# Altium project Booster_Sensors.PrjPcb
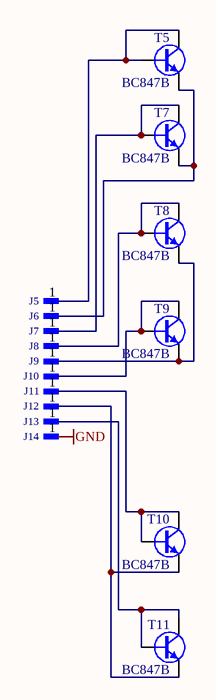
[diagram p0: Booster_Sensors.SchDoc]
1 sheet, 16 parts. Net scope: global (net labels, ports and power ports of the same name join across sheets).
Board file: Booster_Sensors.PcbDoc

## Sheet Booster_Sensors.SchDoc
size A4

### Parts
J5  SMD Pad  [R700X200]  (value not drawn)
J6  SMD Pad  [R700X200]  (value not drawn)
J7  SMD Pad  [R700X200]  (value not drawn)
J8  SMD Pad  [R700X200]  (value not drawn)
J9  SMD Pad  [R700X200]  (value not drawn)
J10  SMD Pad  [R700X200]  (value not drawn)
J11  SMD Pad  [R700X200]  (value not drawn)
J12  SMD Pad  [R700X200]  (value not drawn)
J13  SMD Pad  [R700X200]  (value not drawn)
J14  SMD Pad  [R700X200]  (value not drawn)
T5  BC847B  [SOT95P230X110-3N]
T7  BC847B  [SOT95P230X110-3N]
T8  BC847B  [SOT95P230X110-3N]
T9  BC847B  [SOT95P230X110-3N]
T10  BC847B  [SOT95P230X110-3N]
T11  BC847B  [SOT95P230X110-3N]

### Nets
GND: J14.1
NetJ5_1: J5.1 T5.1(B) T5.3(C)
NetJ6_1: J6.1 T5.2(E) T7.2(E)
NetJ7_1: J7.1 T7.1(B) T7.3(C)
NetJ8_1: J8.1 T8.1(B) T8.3(C)
NetJ9_1: J9.1 T8.2(E) T9.2(E)
NetJ10_1: J10.1 T9.1(B) T9.3(C)
NetJ11_1: J11.1 T10.1(B) T10.3(C)
NetJ12_1: J12.1 T10.2(E) T11.2(E)
NetJ13_1: J13.1 T11.1(B) T11.3(C)

### Library data of the parts
J5-J14 = SMD_PAD_7X2MM: Single SMD Pad; Part Description: 7mm x 2mm SMD Pad; Mounted: No; Part Number: SMD_PAD_7X2MM; Component Kind: Standard (No BOM); Component Type: Standard (No BOM); Pin Count: 1; Family: SMD Pad; Socket: No; SMD: No; Sense: No; Status: None; ComponentHeight: 0mm; HelpURL: Undefined; Author: CERN DEM MR; CreateDate: 09.09.2016; LatestRevisionDate: 09.09.2016; PackageDescription: 7mm x  2mm SMD Pad
T5 T7-T11 = BC847B: NPN Transistor; Part Description: 45V 100mA NPN general-purpose transistors; Manufacturer: NXP SEMICONDUCTORS; PressFit: No; Bonding: No; Part Number: BC847B; Component Kind: Standard; Component Type: Standard; Device: BC847B; PackageDescription: SOT23, 3 pin, Pitch 0.95mm - 1.3mm W X 2.9mm L X 1.1mm H, IPC Medium Density; Manufacturer Part Number: BC847B; Pin Count: 3; Case: SOT23-3; Mounted: Yes; Socket: No; SMD: Yes; Sense: No; ComponentHeight: 1.1mm; HelpURL: \\cern.ch\dfs\Applications\Altium\Datasheets\BC847B.pdf; Author: CERN DEM JLC; CreateDate: 14.06.2011; LatestRevisionDate: 14.06.2011